# EAGLE schematic DemoSensorAddonProto (EAGLE 7.7.0)
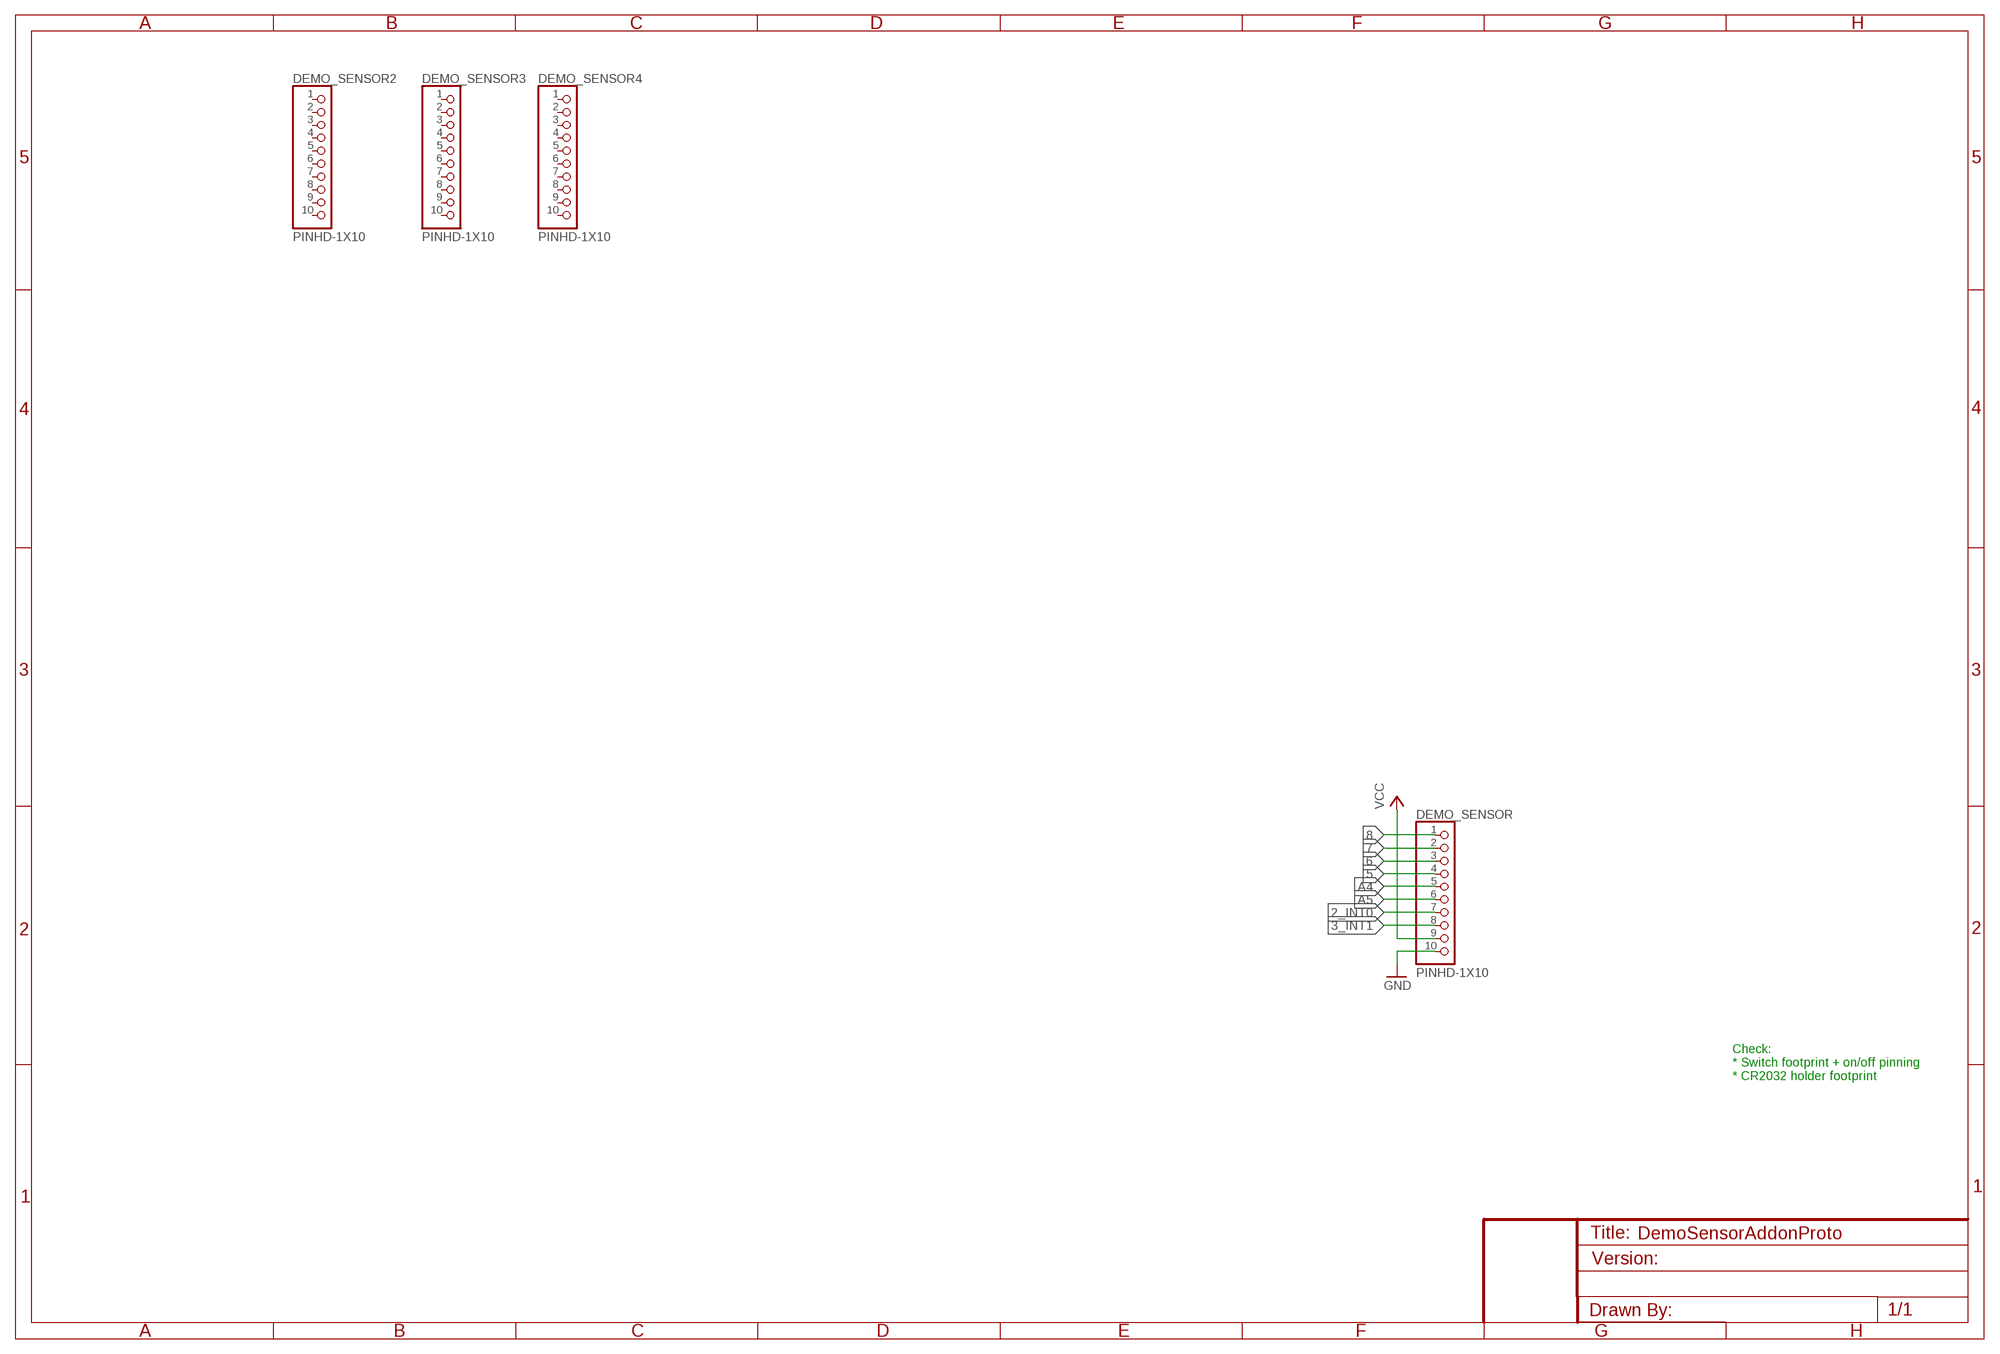
[diagram p0: schematic, sheet 1]

## Parts
DEMO_SENSOR  PINHD-1X10  [1X10-BIG]
DEMO_SENSOR2  PINHD-1X10  [1X10-BIG]
DEMO_SENSOR3  PINHD-1X10  [1X10-BIG]
DEMO_SENSOR4  PINHD-1X10  [1X10-BIG]

## Nets
2_INT0: DEMO_SENSOR.7
3_INT1: DEMO_SENSOR.8
5: DEMO_SENSOR.4
6: DEMO_SENSOR.3
7: DEMO_SENSOR.2
8: DEMO_SENSOR.1
A4: DEMO_SENSOR.5
A5: DEMO_SENSOR.6
GND: DEMO_SENSOR.10
VCC: DEMO_SENSOR.9
Unconnected: DEMO_SENSOR2.1 DEMO_SENSOR2.2 DEMO_SENSOR2.3 DEMO_SENSOR2.4 DEMO_SENSOR2.5 DEMO_SENSOR2.6 DEMO_SENSOR2.7 DEMO_SENSOR2.8 DEMO_SENSOR2.9 DEMO_SENSOR2.10 DEMO_SENSOR3.1 DEMO_SENSOR3.2 DEMO_SENSOR3.3 DEMO_SENSOR3.4 DEMO_SENSOR3.5 DEMO_SENSOR3.6 DEMO_SENSOR3.7 DEMO_SENSOR3.8 DEMO_SENSOR3.9 DEMO_SENSOR3.10 DEMO_SENSOR4.1 DEMO_SENSOR4.2 DEMO_SENSOR4.3 DEMO_SENSOR4.4 DEMO_SENSOR4.5 DEMO_SENSOR4.6 DEMO_SENSOR4.7 DEMO_SENSOR4.8 DEMO_SENSOR4.9 DEMO_SENSOR4.10

## Notes on the sheet
- Check:
  * Switch footprint + on/off pinning
  * CR2032 holder footprint

## Library data of the parts
DEMO_SENSOR DEMO_SENSOR2-DEMO_SENSOR4 = adafruit:PINHD-1X10: Pin header 1x10 0.1" spacing With round pins